# Altium schematic sheet Voltage_measurement.SchDoc
size A4; SheetNumber: 4; SheetTotal: 8; SPICEModelCacheGQXFUCOC: <root> / <DocumentId>GQXFUCOC</DocumentId> / </root>
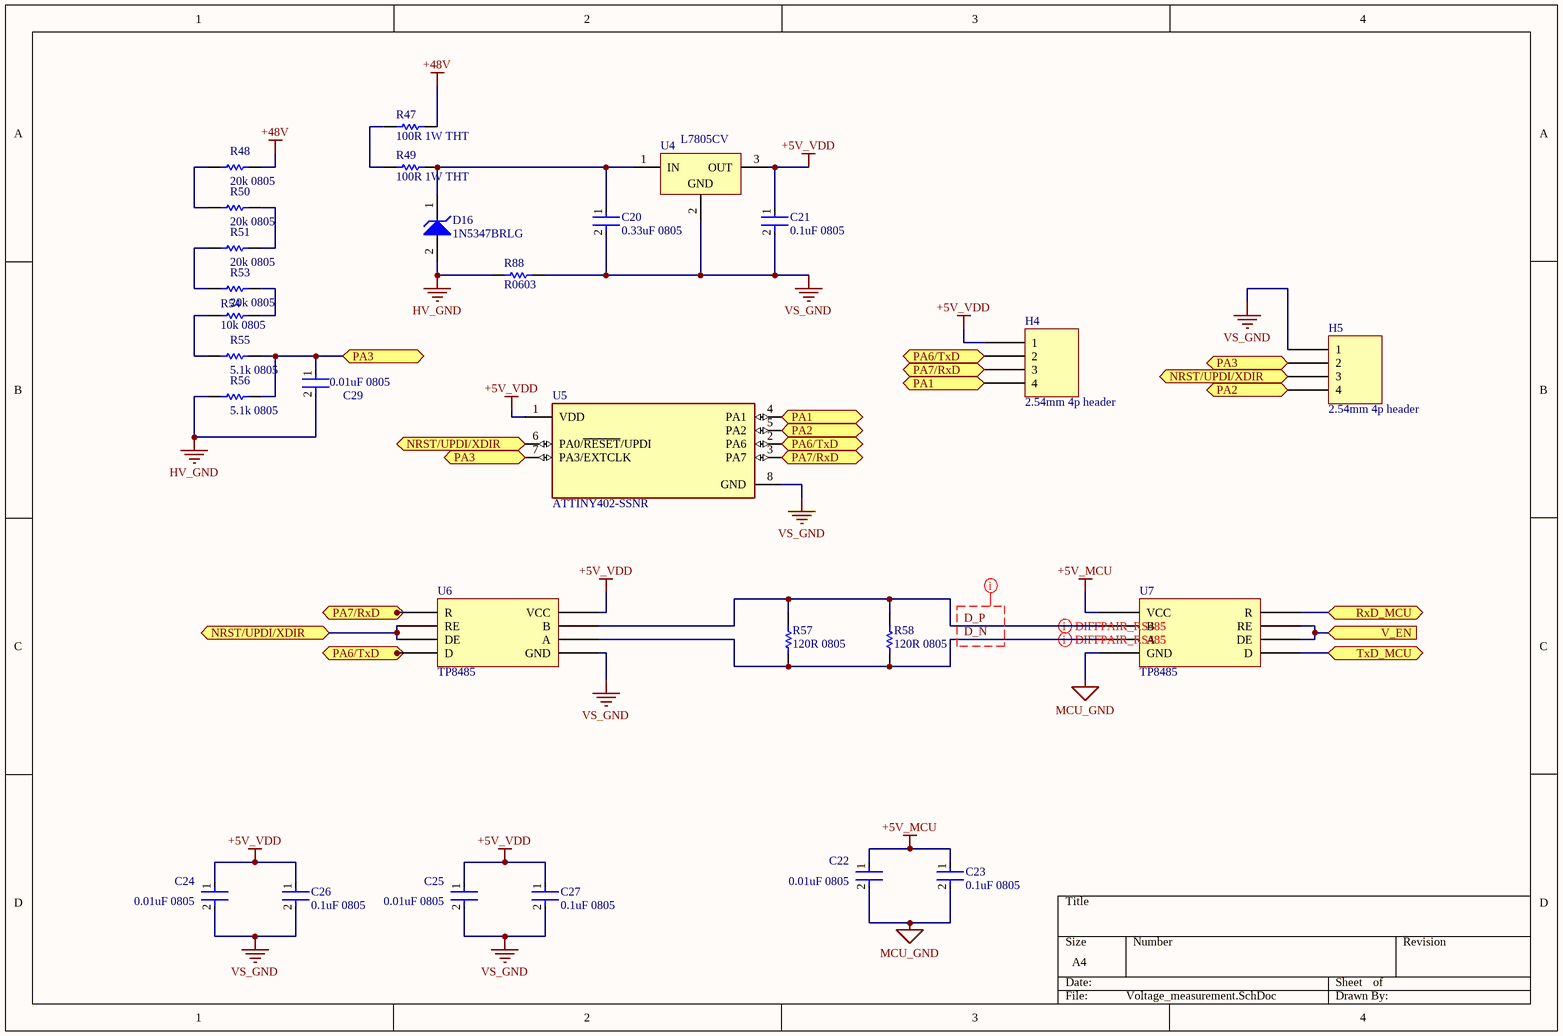
[diagram p0: Voltage_measurement.SchDoc]

## Parts
C20  0.33uF 0805  [R0805]
C21  0.1uF 0805  [R0805]
C22  0.01uF 0805  [R0805]
C23  0.1uF 0805  [R0805]
C24  0.01uF 0805  [R0805]
C25  0.01uF 0805  [R0805]
C26  0.1uF 0805  [R0805]
C27  0.1uF 0805  [R0805]
C29  0.01uF 0805  [R0805]
D16  1N5347BRLG  [ONSC-SURMETIC40-2-017AA-01]
H4  2.54mm 4p header  [2.54mm 4p header]
H5  2.54mm 4p header  [2.54mm 4p header]
R47  100R 1W THT  [1W THT]
R48  20k 0805  [R0805]
R49  100R 1W THT  [1W THT]
R50  20k 0805  [R0805]
R51  20k 0805  [R0805]
R53  20k 0805  [R0805]
R54  10k 0805  [R0805]
R55  5.1k 0805  [R0805]
R56  5.1k 0805  [R0805]
R57  120R 0805  [R0805]
R58  120R 0805  [R0805]
R88  R0603  [R0603]
U4  L7805CV  [TO220]
U5  ATTINY402-SSNR  [FP-C04-057-SWB-IPC_C]
U6  TP8485  [TP8485]
U7  TP8485  [TP8485]

## Ports
NRST/UPDI/XDIR (bidir), PA1 (bidir), PA2 (bidir), PA3 (bidir), PA6/TxD (bidir), PA7/RxD (bidir), RxD_MCU (bidir), TxD_MCU (bidir), V_EN (in)

## Nets
+5V_MCU: C22.1 C23.1 U7.8(VCC)
+5V_VDD: C21.1 C24.1 C25.1 C26.1 C27.1 H4.1 U4.3(OUT) U5.1(VDD) U6.8(VCC)
+48V: R47.1 R48.2
HV_GND: C29.2 D16.2(A) R56.1 R88.1
MCU_GND: C22.2 C23.2 U7.5(GND)
VS_GND: C20.2 C21.2 C24.2 C25.2 C26.2 C27.2 H5.1 R88.2 U4.2(GND) U5.8(GND) U6.5(GND)
D_N: R57.1 R58.1 U6.6(A) U7.6(A)
D_P: R57.2 R58.2 U6.7(B) U7.7(B)
NRST/UPDI/XDIR: H5.3 U5.6(PA0/~{RESET}/UPDI) U6.2(RE) U6.3(DE) ; port NRST/UPDI/XDIR
PA1: H4.4 U5.4(PA1) ; port PA1
PA2: H5.4 U5.5(PA2) ; port PA2
PA3: C29.1 H5.2 R55.2 R56.2 U5.7(PA3/EXTCLK) ; port PA3
PA6/TxD: H4.2 U5.2(PA6) U6.4(D) ; port PA6/TxD
PA7/RxD: H4.3 U5.3(PA7) U6.1(R) ; port PA7/RxD
RxD_MCU: U7.1(R) ; port RxD_MCU
TxD_MCU: U7.4(D) ; port TxD_MCU
V_EN: U7.2(RE) U7.3(DE) ; port V_EN
NetC20_1: C20.1 D16.1(K) R49.1 U4.1(IN)
NetR47_2: R47.2 R49.2
NetR48_1: R48.1 R50.1
NetR50_2: R50.2 R51.2
NetR51_1: R51.1 R53.1
NetR53_2: R53.2 R54.1
NetR54_2: R54.2 R55.1

## Layout directives
differential pair; differential pair class RS485: D_N, D_P
net class RS485; rule Differential Pairs Routing [Pref Gap = 0.3mm    Min Gap  = 0.3mm    Max Gap  = 0.4mmPref Width = 0.6mm    Min Width  = 0.5mm    Max Width  = 0.6mm]: D_N, D_P

## Library data of the parts
C20 = 0.1uF 0805: 0.33uF/330nF 50V Capacitor ±10% Tolerance CC0805KKX7R9BB334 – 0805 Package; Product URL: https://sharvielectronics.com/product/0-33uf-330nf-50v-capacitor-%C2%B110-tolerance-cc0805kkx7r9bb334-0805-package/; Price per piece: 2.78; Datasheet: https://drive.google.com/file/d/1wr2K_YaGqgMtACeU2pC6RWLSxDMrIPxr/view?usp=sharing
C21 C23 C26 C27 = 0.1uF 0805: 0.1uF/100nF 100V Capacitor ±10% Tolerance CC0805KKX7R0BB104 – 0805 Package; Product URL: https://sharvielectronics.com/product/0-1uf-100nf-100v-capacitor-%c2%b110-tolerance-cc0805kkx7r0bb104-0805-package/; Price per piece: 4.76; Datasheet: https://drive.google.com/file/d/1wr2K_YaGqgMtACeU2pC6RWLSxDMrIPxr/view?usp=sharing
C22 C24 C25 C29 = 0.01uF 0805: 10nF/0.01uF 50V Capacitor ±10% Tolerance 0805B103K500CT – 0805 Package; Product URL: https://sharvielectronics.com/product/10nf-0-01uf-50v-capacitor-%c2%b110-tolerance-0805b103k500ct-0805-package/; Price per piece: 2.45; Datasheet: https://drive.google.com/file/d/18RHnvRuuuVekgJyOA4l8O3UUaSpuKbHR/view?usp=sharing
D16 = CMP-1060-01277-1: 5 W Zener Voltage Regulator, 2-Pin Surmetic(TM) 40, Pb-Free, Tape and Reel; Manufacturer: On Semiconductor; VZ Typ (V): 10; P Max (W): 5; Packing: Tape and Reel; PackageReference: SURMETIC40-2-017AA-01; ComponentLink3Description: Package Specification; PartNumber: 1N5347BRLG; ComponentLink3URL: http://www.onsemi.cn/pub_link/Collateral/017AA.PDF; PackageVersion: Rev. O, 09/2005; ComponentLink1URL: http://www.onsemi.com/; DatasheetVersion: Rev. 14; ComponentLink2URL: http://www.onsemi.cn/pub_link/Collateral/1N5333B-D.PDF; RoHS: Pb-Free; ComponentLink1Description: Manufacturer URL; PackageDescription: 2-Pin, Axial Lead, Diameter 3.49 mm; Mounting Technology: Through Hole; ComponentLink2Description: Datasheet; Product URl: https://sharvielectronics.com/product/1n5347b-10v-5-watt-zener-diode-do-35-package/; Price per piece: 16.89; Datasheet: https://drive.google.com/file/d/1Ga-c_Md0AeMcY8wCGBIrhHknR-aAM12m/view?usp=sharing
R47 R49 = 100R 1W THT: 100 Ohm 1 Watt Resistor 5% Tolerance; Price per piece: 2.14; Product URL: https://sharvielectronics.com/product/100-ohm-1-watt-resistor-5-tolerance/
R48 R50 R51 R53 = R0805: 20K ohm 1/8 Watt SMD Resistor 1% Tolerance RC0805FR-0720KL – 0805 Package; Price per piece: 1.15; Product URL: https://sharvielectronics.com/product/20k-ohm-1-8-watt-smd-resistor-1-tolerance-rc0805fr-0720kl-0805-package/; Datasheet: https://drive.google.com/file/d/1pkLQT_RQ1i35oFQcGREpZr7Oy3Ppi-ZT/view?usp=sharing
R54 = 10k 0805: 10K Ohm 1/8 Watt Resistor 1% Tolerance RC0805FR-0710KL – 0805 Package; Price per piece: 0.82; Product URL: https://sharvielectronics.com/product/10k-ohm-1-8-watt-resistor-1-tolerance-rc0805fr-0710kl-0805-package/; Datasheet: https://drive.google.com/file/d/1pkLQT_RQ1i35oFQcGREpZr7Oy3Ppi-ZT/view?usp=sharing
R55 R56 = R0805: 5.1K Ohm 1/8 Watt Resistor 1% Tolerance 0805S8F5101T5E – 0805 Package; Price per piece: 1.92; Product URL: https://sharvielectronics.com/product/5-1k-ohm-1-8-watt-resistor-1-tolerance-0805s8f5101t5e-0805-package/; Datasheet: https://drive.google.com/file/d/1rtx85iFJaMrDbsv7PAzG9bTFItPmAE38/view?usp=sharing
R57 R58 = R0805: 120 Ohm 1/8 Watt Resistor 1% Tolerance RC0805FR-07120RL – 0805 Package; Variant: 62 Ohm 1/8 Watt Resistor 1% Tolerance RC0805FR-0762RL – 0805 Package; Price per piece: 0.86; Product URL: https://sharvielectronics.com/product/120-ohm-1-8-watt-resistor-1-tolerance-rc0805fr-07120rl-0805-package/; Datasheet: https://drive.google.com/file/d/1pkLQT_RQ1i35oFQcGREpZr7Oy3Ppi-ZT/view?usp=sharing
U4 = CMP-0244-00483-1: Positive Voltage Regulator, 5V, 3-Pin TO-220; PackageDescription: TO, Thru-Hole, Vertical, Heatsink Mounted; 3 In-Line Leads; Pitch 2.54 mm; ComponentLink2Description: Datasheet; PackageReference: TO220; ComponentLink3URL: http://www.st.com/internet/com/TECHNICAL_RESOURCES/TECHNICAL_LITERATURE/PACKAGE_INFORMATION/CD00004649.pdf; DatasheetVersion: 16/11/2011; ComponentLink1Description: Manufacturer URL; ComponentLink1URL: http://www.st.com; PackageVersion: ver3.0; ComponentLink3Description: Package Specification; ComponentLink2URL: http://www.st.com/internet/com/TECHNICAL_RESOURCES/TECHNICAL_LITERATURE/DATASHEET/CD00000444.pdf
U5 = CMP-06276-000139-1: IC MCU 8BIT 4KB FLASH 8SOIC; Core Architecture: AVR; Interface: I2C; Frequency: 20MHz; Oscillator Type: Internal; Peripherals: Brown-out Detect/Reset; Number of I/Os: 6; Memory Size: 4KB; Min Operating Temperature: -40°C; Memory Type: FLASH; Case/Package: SOIC; Packaging: Tape and Reel; Max Operating Temperature: 105°C; Number of Pins: 8; RoHS Compliant: Yes
U6 U7 = TP8485: TP8485E – RS485 Transceiver Interface IC SOIC-8 Package; Product URL: https://sharvielectronics.com/product/tp8485e-rs485-transceiver-interface-ic-soic-8-package/; Price per piece: 28.94; Datasheet: https://drive.google.com/file/d/1U_aS4Uf2IPB18ZIqPadQc-TMP5dizR4y/view?usp=sharing
H4 H5 = 2.54mm 4p header: Price per piece: *; Product URL: *; Datasheet: *
R88 = R0603: Price per Piece: *; Product URL: *; Datasheet: *